# EAGLE design TU56o (EAGLE 6.6.0)
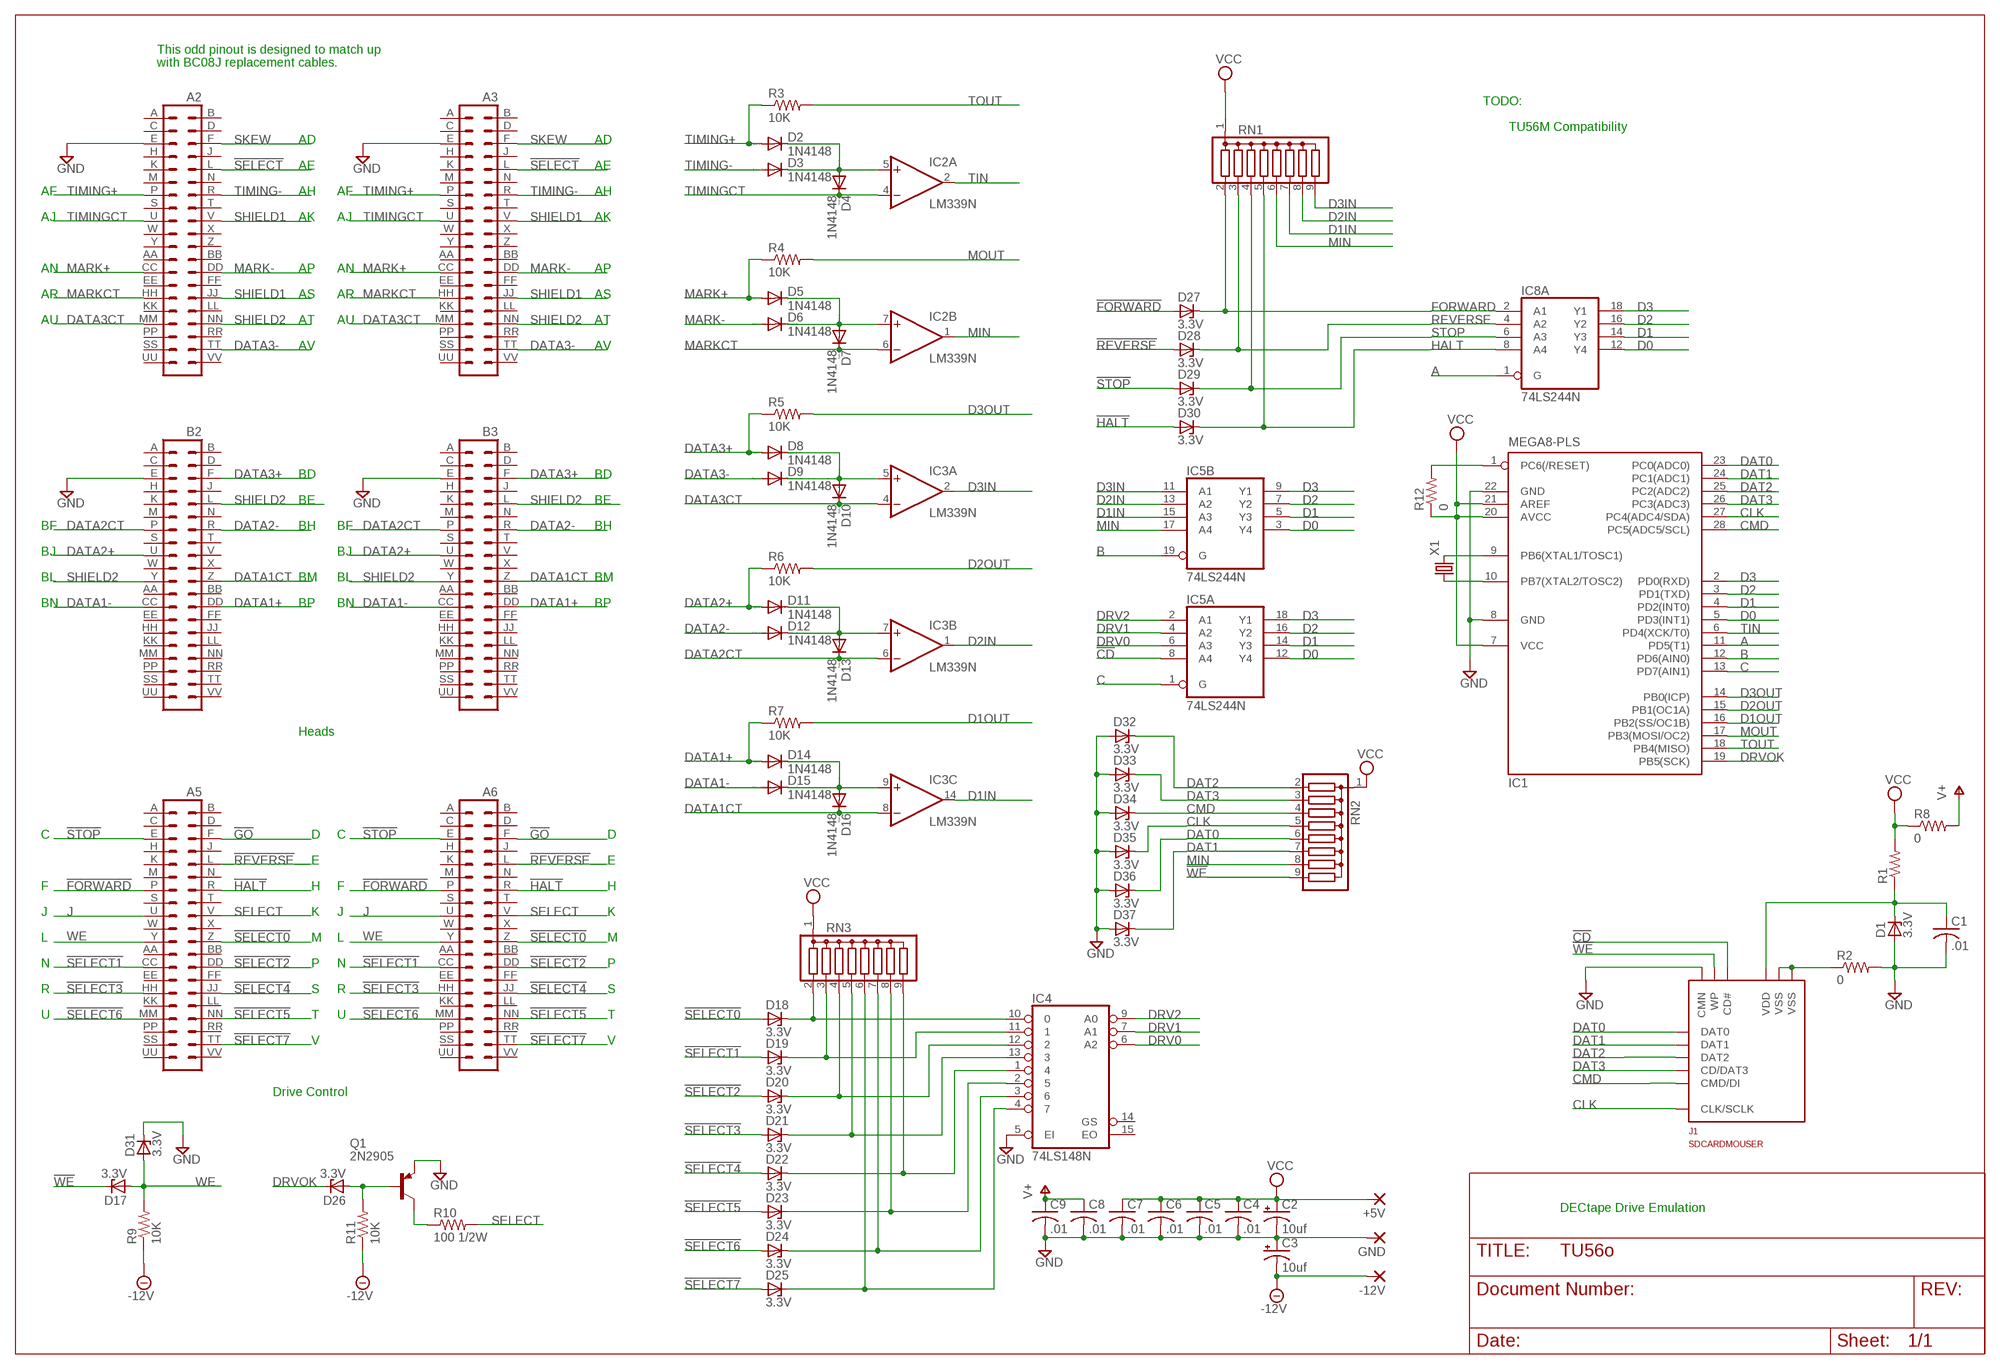
[diagram p0: schematic, sheet 1]

## Parts
+5V  2,15/1,0  [2,15/1,0]
-12V  2,15/1,0  [2,15/1,0]
A2  DEC40PINV  [DEC40PINV]
A3  DEC40PINV  [DEC40PINV]
A5  DEC40PINV  [DEC40PINV]
A6  DEC40PINV  [DEC40PINV]
B2  DEC40PINV  [DEC40PINV]
B3  DEC40PINV  [DEC40PINV]
C1  .01  C-US050-025X075  [C050-025X075]
C2  10uf  CPOL-USE2.5-7  [E2,5-7]
C3  10uf  CPOL-USE2.5-7  [E2,5-7]
C4  .01  C-US050-025X075  [C050-025X075]
C5  .01  C-US050-025X075  [C050-025X075]
C6  .01  C-US050-025X075  [C050-025X075]
C7  .01  C-US050-025X075  [C050-025X075]
C8  .01  C-US050-025X075  [C050-025X075]
C9  .01  C-US050-025X075  [C050-025X075]
D1  3.3V  ZENER-DIODEDO35Z10  [DO35Z10]
D2  1N4148  1N4148DO35-10  [DO35-10]
D3  1N4148  1N4148DO35-10  [DO35-10]
D4  1N4148  1N4148DO35-10  [DO35-10]
D5  1N4148  1N4148DO35-10  [DO35-10]
D6  1N4148  1N4148DO35-10  [DO35-10]
D7  1N4148  1N4148DO35-10  [DO35-10]
D8  1N4148  1N4148DO35-10  [DO35-10]
D9  1N4148  1N4148DO35-10  [DO35-10]
D10  1N4148  1N4148DO35-10  [DO35-10]
D11  1N4148  1N4148DO35-10  [DO35-10]
D12  1N4148  1N4148DO35-10  [DO35-10]
D13  1N4148  1N4148DO35-10  [DO35-10]
D14  1N4148  1N4148DO35-10  [DO35-10]
D15  1N4148  1N4148DO35-10  [DO35-10]
D16  1N4148  1N4148DO35-10  [DO35-10]
D17  3.3V  ZENER-DIODEDO35Z10  [DO35Z10]
D18  3.3V  ZENER-DIODEDO35Z10  [DO35Z10]
D19  3.3V  ZENER-DIODEDO35Z10  [DO35Z10]
D20  3.3V  ZENER-DIODEDO35Z10  [DO35Z10]
D21  3.3V  ZENER-DIODEDO35Z10  [DO35Z10]
D22  3.3V  ZENER-DIODEDO35Z10  [DO35Z10]
D23  3.3V  ZENER-DIODEDO35Z10  [DO35Z10]
D24  3.3V  ZENER-DIODEDO35Z10  [DO35Z10]
D25  3.3V  ZENER-DIODEDO35Z10  [DO35Z10]
D26  3.3V  ZENER-DIODEDO35Z10  [DO35Z10]
D27  3.3V  ZENER-DIODEDO35Z10  [DO35Z10]
D28  3.3V  ZENER-DIODEDO35Z10  [DO35Z10]
D29  3.3V  ZENER-DIODEDO35Z10  [DO35Z10]
D30  3.3V  ZENER-DIODEDO35Z10  [DO35Z10]
D31  3.3V  ZENER-DIODEDO35Z10  [DO35Z10]
D32  3.3V  ZENER-DIODEDO35Z10  [DO35Z10]
D33  3.3V  ZENER-DIODEDO35Z10  [DO35Z10]
D34  3.3V  ZENER-DIODEDO35Z10  [DO35Z10]
D35  3.3V  ZENER-DIODEDO35Z10  [DO35Z10]
D36  3.3V  ZENER-DIODEDO35Z10  [DO35Z10]
D37  3.3V  ZENER-DIODEDO35Z10  [DO35Z10]
GND  2,15/1,0  [2,15/1,0]
IC1  MEGA8-PLS  [DIL28-3]
IC2  LM339N  [DIL14]
IC3  LM339N  [DIL14]
IC4  74LS148N  [DIL16]
IC5  74LS244N  [DIL20]
IC8  74LS244N  [DIL20]
J1  SDCARDMOUSER  [SCDA1A]
Q1  2N2905  [TO5]
R1  R-US_0207/10  [0207/10]
R2  0  R-US_0207/10  [0207/10]
R3  10K  R-US_0207/10  [0207/10]
R4  10K  R-US_0207/10  [0207/10]
R5  10K  R-US_0207/10  [0207/10]
R6  10K  R-US_0207/10  [0207/10]
R7  10K  R-US_0207/10  [0207/10]
R8  0  R-US_0207/10  [0207/10]
R9  10K  R-US_0207/10  [0207/10]
R10  100 1/2W  R-US_0309/V  [0309V]
R11  10K  R-US_0207/10  [0207/10]
R12  0  R-US_0207/10  [0207/10]
RN1  G08R  [SIL9]
RN2  G08R  [SIL9]
RN3  G08R  [SIL9]
X1  CRYSTALHC49S  [HC49/S]

## Nets
!CD: IC5.8(A:A4) J1.10(CD#)
!FORWARD: A5.P A6.P D27.A
!GO: A5.F A6.F
!HALT: A5.R A6.R D30.A
!REVERSE: A5.L A6.L D28.A
!SELECT: A2.L A3.L
!SELECT0: A5.Z A6.Z D18.A
!SELECT1: A5.CC A6.CC D19.A
!SELECT2: A5.DD A6.DD D20.A
!SELECT3: A5.HH A6.HH D21.A
!SELECT4: A5.JJ A6.JJ D22.A
!SELECT5: A5.NN A6.NN D23.A
!SELECT6: A5.MM A6.MM D24.A
!SELECT7: A5.TT A6.TT D25.A
!STOP: A5.E A6.E D29.A
!WE: D17.C J1.12(WP) RN2.9
-12V [Supply]: -12V.1(P) C3.- R9.1 R11.1
A: IC1.11(PD5(T1)) IC8.1(A:G)
B: IC1.12(PD6(AIN0)) IC5.19(B:G)
C: IC1.13(PD7(AIN1)) IC5.1(A:G)
CLK: D35.C IC1.27(PC4(ADC4/SDA)) J1.5(CLK/SCLK) RN2.5
CMD: D34.C IC1.28(PC5(ADC5/SCL)) J1.2(CMD/DI) RN2.4
D0: IC1.5(PD3(INT1)) IC5.3(B:Y4) IC5.12(A:Y4) IC8.12(A:Y4)
D1: IC1.4(PD2(INT0)) IC5.5(B:Y3) IC5.14(A:Y3) IC8.14(A:Y3)
D1IN: IC3.14(C:OUT) IC5.15(B:A3) RN1.7
D1OUT: IC1.16(PB2(SS/OC1B)) R7.2
D2: IC1.3(PD1(TXD)) IC5.7(B:Y2) IC5.16(A:Y2) IC8.16(A:Y2)
D2IN: IC3.1(B:OUT) IC5.13(B:A2) RN1.8
D2OUT: IC1.15(PB1(OC1A)) R6.2
D3: IC1.2(PD0(RXD)) IC5.9(B:Y1) IC5.18(A:Y1) IC8.18(A:Y1)
D3IN: IC3.2(A:OUT) IC5.11(B:A1) RN1.9
D3OUT: IC1.14(PB0(ICP)) R5.2
DAT0: D36.C IC1.23(PC0(ADC0)) J1.7(DAT0) RN2.6
DAT1: D37.C IC1.24(PC1(ADC1)) J1.8(DAT1) RN2.7
DAT2: D32.C IC1.25(PC2(ADC2)) J1.9(DAT2) RN2.2
DAT3: D33.C IC1.26(PC3(ADC3)) J1.1(CD/DAT3) RN2.3
DATA1+: B2.DD B3.DD D14.A R7.1
DATA1-: B2.CC B3.CC D15.A
DATA1CT: B2.Z B3.Z D16.C IC3.8(C:-IN)
DATA2+: B2.U B3.U D11.A R6.1
DATA2-: B2.R B3.R D12.A
DATA2CT: B2.P B3.P D13.C IC3.6(B:-IN)
DATA3+: B2.F B3.F D8.A R5.1
DATA3-: A2.TT A3.TT D9.A
DATA3CT: A2.MM A3.MM D10.C IC3.4(A:-IN)
DRV0: IC4.6(A2) IC5.6(A:A3)
DRV1: IC4.7(A1) IC5.4(A:A2)
DRV2: IC4.9(A0) IC5.2(A:A1)
DRVOK: D26.C IC1.19(PB5(SCK))
FORWARD: D27.C IC8.2(A:A1) RN1.2
GND [Supply]: A2.E A3.E B2.E B3.E C1.2 C2.- C3.+ C4.2 C5.2 C6.2 C7.2 C8.2 C9.2 D1.A D31.C D32.A D33.A D34.A D35.A D36.A D37.A GND.1(P) IC1.8(GND) IC1.22(GND) IC4.5(EI) J1.11(CMN) Q1.1(E) R2.2
HALT: D30.C IC8.8(A:A4) RN1.5
J: A5.U A6.U
MARK+: A2.CC A3.CC D5.A R4.1
MARK-: A2.DD A3.DD D6.A
MARKCT: A2.HH A3.HH D7.C IC2.6(B:-IN)
MIN: IC2.1(B:OUT) IC5.17(B:A4) RN1.6 RN2.8
MOUT: IC1.17(PB3(MOSI/OC2)) R4.2
N$1: IC1.10(PB7(XTAL2/TOSC2)) X1.1
N$2: IC1.9(PB6(XTAL1/TOSC1)) X1.2
N$3: D18.C IC4.10 RN3.2
N$4: D19.C IC4.11 RN3.3
N$5: D20.C IC4.12 RN3.4
N$7: D2.C D3.C D4.A IC2.5(A:+IN)
N$8: D21.C IC4.13 RN3.5
N$9: D22.C IC4.1 RN3.9
N$10: D23.C IC4.2 RN3.8
N$11: D5.C D6.C D7.A IC2.7(B:+IN)
N$12: D8.C D9.C D10.A IC3.5(A:+IN)
N$13: D11.C D12.C D13.A IC3.7(B:+IN)
N$14: D14.C D15.C D16.A IC3.9(C:+IN)
N$15: D24.C IC4.3 RN3.7
N$16: D25.C IC4.4 RN3.6
N$17: IC1.1(PC6(/RESET)) R12.2
N$18: Q1.3(C) R10.1
N$19: D26.A Q1.2(B) R11.2
REVERSE: D28.C IC8.4(A:A2) RN1.3
SELECT: A5.V A6.V R10.2
SHIELD1 [Supply]: A2.JJ A2.V A3.JJ A3.V
SHIELD2 [Supply]: A2.NN A3.NN B2.L B2.Y B3.L B3.Y
SKEW: A2.F A3.F
STOP: D29.C IC8.6(A:A3) RN1.4
TIMING+: A2.P A3.P D2.A R3.1
TIMING-: A2.R A3.R D3.A
TIMINGCT: A2.U A3.U D4.C IC2.4(A:-IN)
TIN: IC1.6(PD4(XCK/T0)) IC2.2(A:OUT)
TOUT: IC1.18(PB4(MISO)) R3.2
V+ [Supply]: C8.1 C9.1 R8.2
VCC [Supply]: +5V.1(P) C2.+ C4.1 C5.1 C6.1 C7.1 IC1.7(VCC) IC1.20(AVCC) IC1.21(AREF) R1.2 R8.1 R12.1 RN1.1 RN2.1 RN3.1
VDD [Supply]: C1.1 D1.C J1.4(VDD) R1.1
VSS [Supply]: J1.3(VSS) J1.6(VSS) R2.1
WE: A5.Y A6.Y D17.A D31.A R9.2
Unconnected: A2.A A2.AA A2.B A2.BB A2.C A2.D A2.EE A2.FF A2.H A2.J A2.K A2.KK A2.LL A2.M A2.N A2.PP A2.RR A2.S A2.SS A2.T A2.UU A2.VV A2.W A2.X A2.Y A2.Z A3.A A3.AA A3.B A3.BB A3.C A3.D A3.EE A3.FF A3.H A3.J A3.K A3.KK A3.LL A3.M A3.N A3.PP A3.RR A3.S A3.SS A3.T A3.UU A3.VV A3.W A3.X A3.Y A3.Z A5.A A5.AA A5.B A5.BB A5.C A5.D A5.EE A5.FF A5.H A5.J A5.K A5.KK A5.LL A5.M A5.N A5.PP A5.RR A5.S A5.SS A5.T A5.UU A5.VV A5.W A5.X A6.A A6.AA A6.B A6.BB A6.C A6.D A6.EE A6.FF A6.H A6.J A6.K A6.KK A6.LL A6.M A6.N A6.PP A6.RR A6.S A6.SS A6.T A6.UU A6.VV A6.W A6.X B2.A B2.AA B2.B B2.BB B2.C B2.D B2.EE B2.FF B2.H B2.HH B2.J B2.JJ B2.K B2.KK B2.LL B2.M B2.MM B2.N B2.NN B2.PP B2.RR B2.S B2.SS B2.T B2.TT B2.UU B2.V B2.VV B2.W B2.X B3.A B3.AA B3.B B3.BB B3.C B3.D B3.EE B3.FF B3.H B3.HH B3.J B3.JJ B3.K B3.KK B3.LL B3.M B3.MM B3.N B3.NN B3.PP B3.RR B3.S B3.SS B3.T B3.TT B3.UU B3.V B3.VV B3.W B3.X IC2.8(C:-IN) IC2.9(C:+IN) IC2.10(D:-IN) IC2.11(D:+IN) IC2.13(D:OUT) IC2.14(C:OUT) IC3.10(D:-IN) IC3.11(D:+IN) IC3.13(D:OUT) IC4.14(GS) IC4.15(EO) IC8.3(B:Y4) IC8.5(B:Y3) IC8.7(B:Y2) IC8.9(B:Y1) IC8.11(B:A1) IC8.13(B:A2) IC8.15(B:A3) IC8.17(B:A4) IC8.19(B:G)

## Notes on the sheet
- This odd pinout is designed to match up
- with BC08J replacement cables.
- TODO:
- TU56M Compatibility
- AD | AD
- AE | AE
- AF | AH | AF | AH
- AJ | AK | AJ | AK
- AN | AP | AN | AP
- AR | AS | AR | AS
- AU | AT | AU | AT
- AV | AV
- BD | BD
- BE | BE
- BF | BH | BF | BH
- BJ | BJ
- BL | BM | BL | BM
- BN | BP | BN | BP
- Heads
- C | D | C | D
- E | E
- F | H | F | H
- J | K | J | K
- L | M | L | M
- N | P | N | P
- R | S | R | S
- U | T | U | T
- V | V
- Drive Control
- DECtape Drive Emulation

## Power pins joined to a net without a drawn wire
GND: IC2.12(P:GND) IC3.12(P:GND) IC4.8(GND) IC5.10(P:GND) IC8.10(P:GND) J1.13(GND) J1.14(GND)
V+: IC2.3(P:V+) IC3.3(P:V+)
VCC: IC4.16(VCC) IC5.20(P:VCC) IC8.20(P:VCC)

## Library data of the parts
+5V -12V GND = wirepad:2,15/1,0: THROUGH-HOLE PAD
A2 A3 A5 A6 B2 B3 = dec-con:DEC40PIN: PIN HEADER
C1 C4-C9 = rcl:C-US: CAPACITOR, American symbol
C2 C3 = rcl:CPOL-US: POLARIZED CAPACITOR, American symbol
D1 D17-D37 = diode:ZENER-DIODE: Z-Diode
D2-D16 = diode:1N4148: DIODE high speed (Philips)
IC1 = atmel:MEGA8-P: MICROCONTROLLER 8 Kbytes FLASH, 1 kbytes SRAM, 512 bytes EEPROM, USART, 4-channel 10 bit ADC, 2-channel 8 bit ADC Pin compatible with Atmega48, ATMega88, ATMega168 Source: avr.lbr
IC2 IC3 = linear:LM339: Low Power Low Offset Voltage Quad Comparators with open collector; LM139/LM239/LM339/LM2901/LM3302
IC4 = 74xx-us:74*148: 10-line to 4-line and 8-line to 3-line PRIORITY ENCODER
IC5 IC8 = 74xx-us:74*244: Octal BUFFER and LINE DRIVER, 3-state
J1 = sdcards:SDCARD: SD Card Holder
Q1 = transistor-pnp:2N2905: PNP Transistor
R1-R12 = rcl:R-US_: RESISTOR, American symbol
RN1-RN3 = resistor-sil:G08R: SIL RESISTOR; OC_FARNELL: unknown; OC_NEWARK: unknown
X1 = crystal:CRYSTAL: CRYSTAL; OC_FARNELL: 1667008; OC_NEWARK: unknown

## Net classes
1 Supply: width 0.508 mm, clearance 0.381 mm

## Board
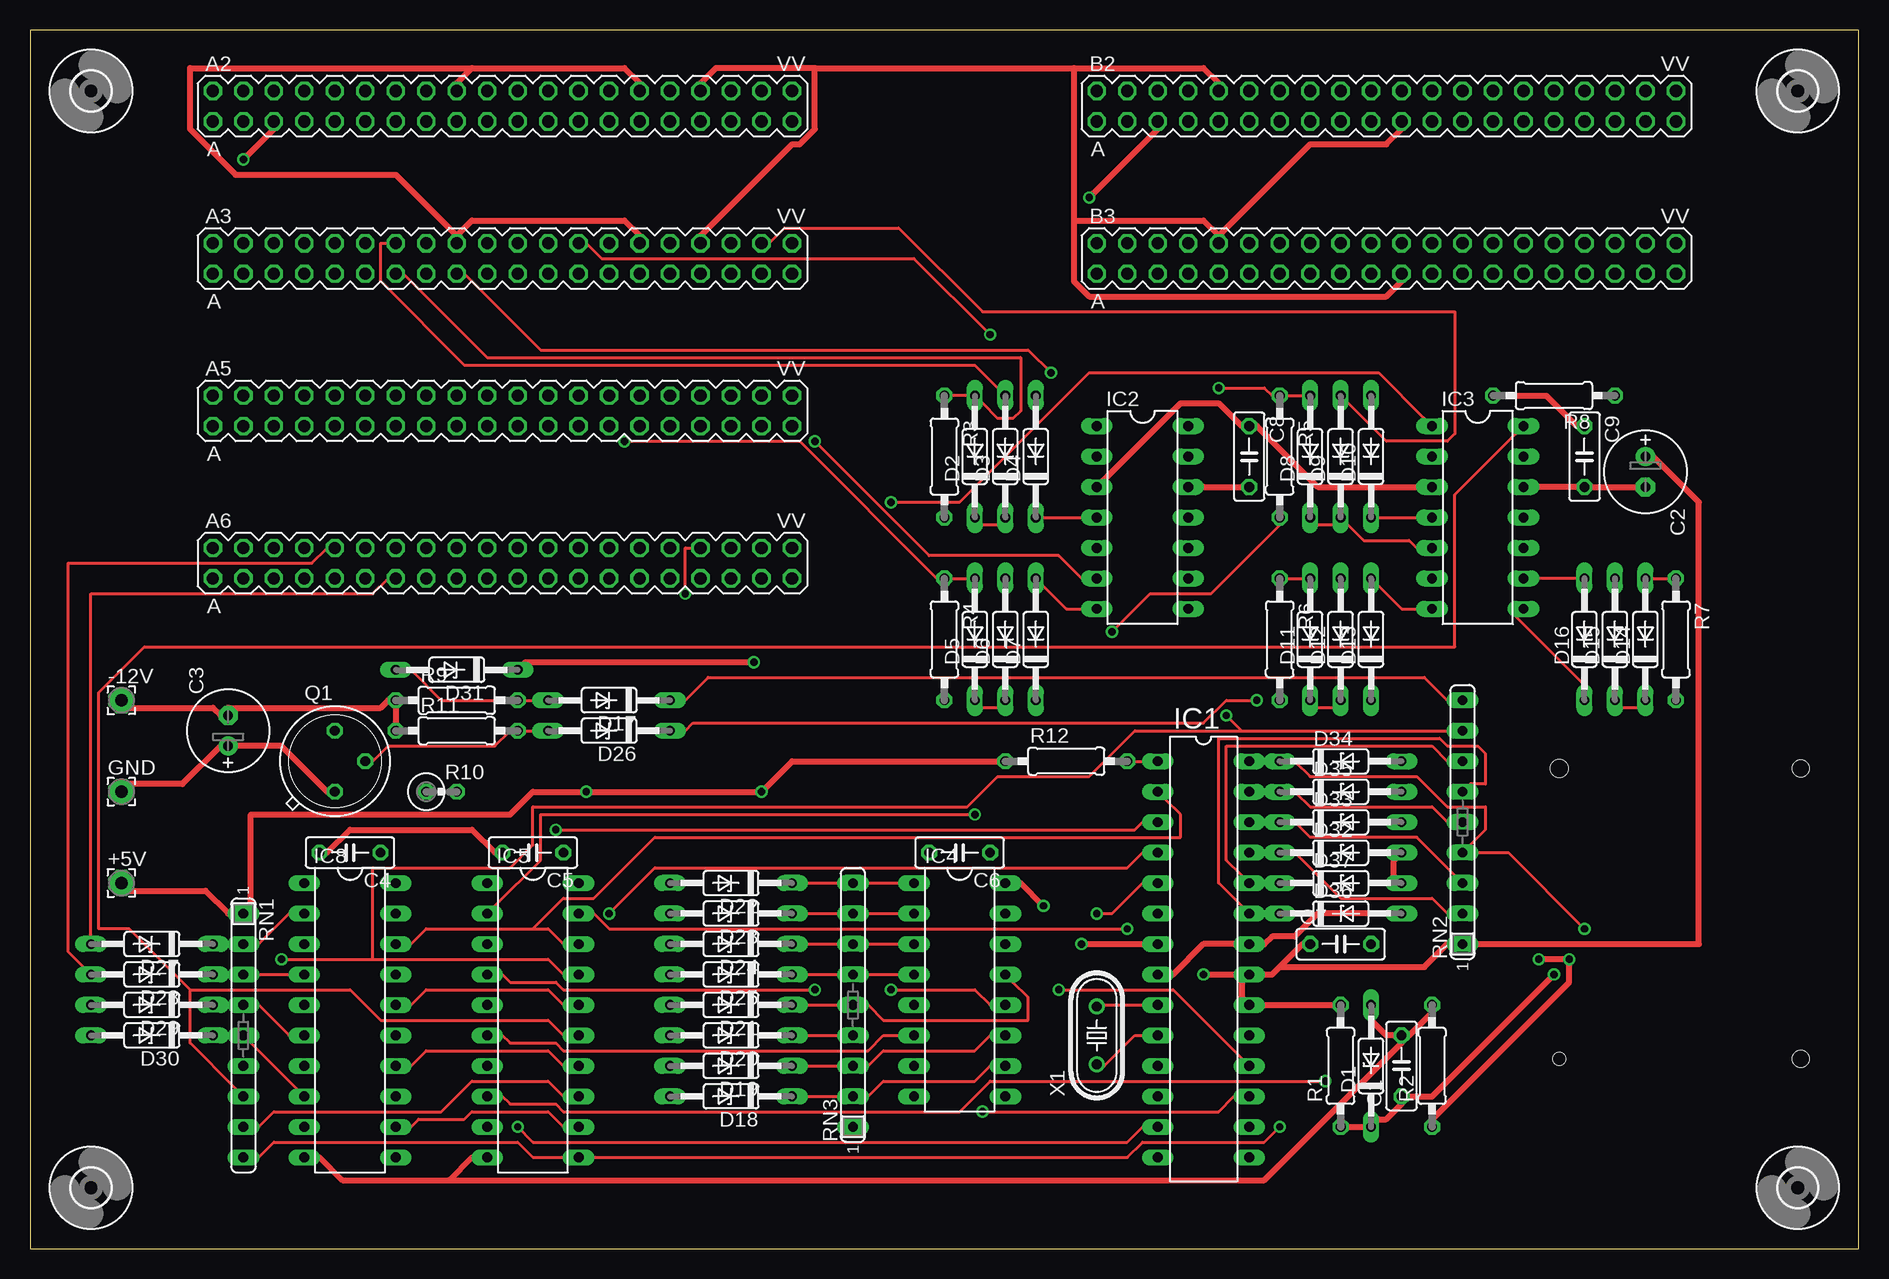
[diagram p1: board, top side]
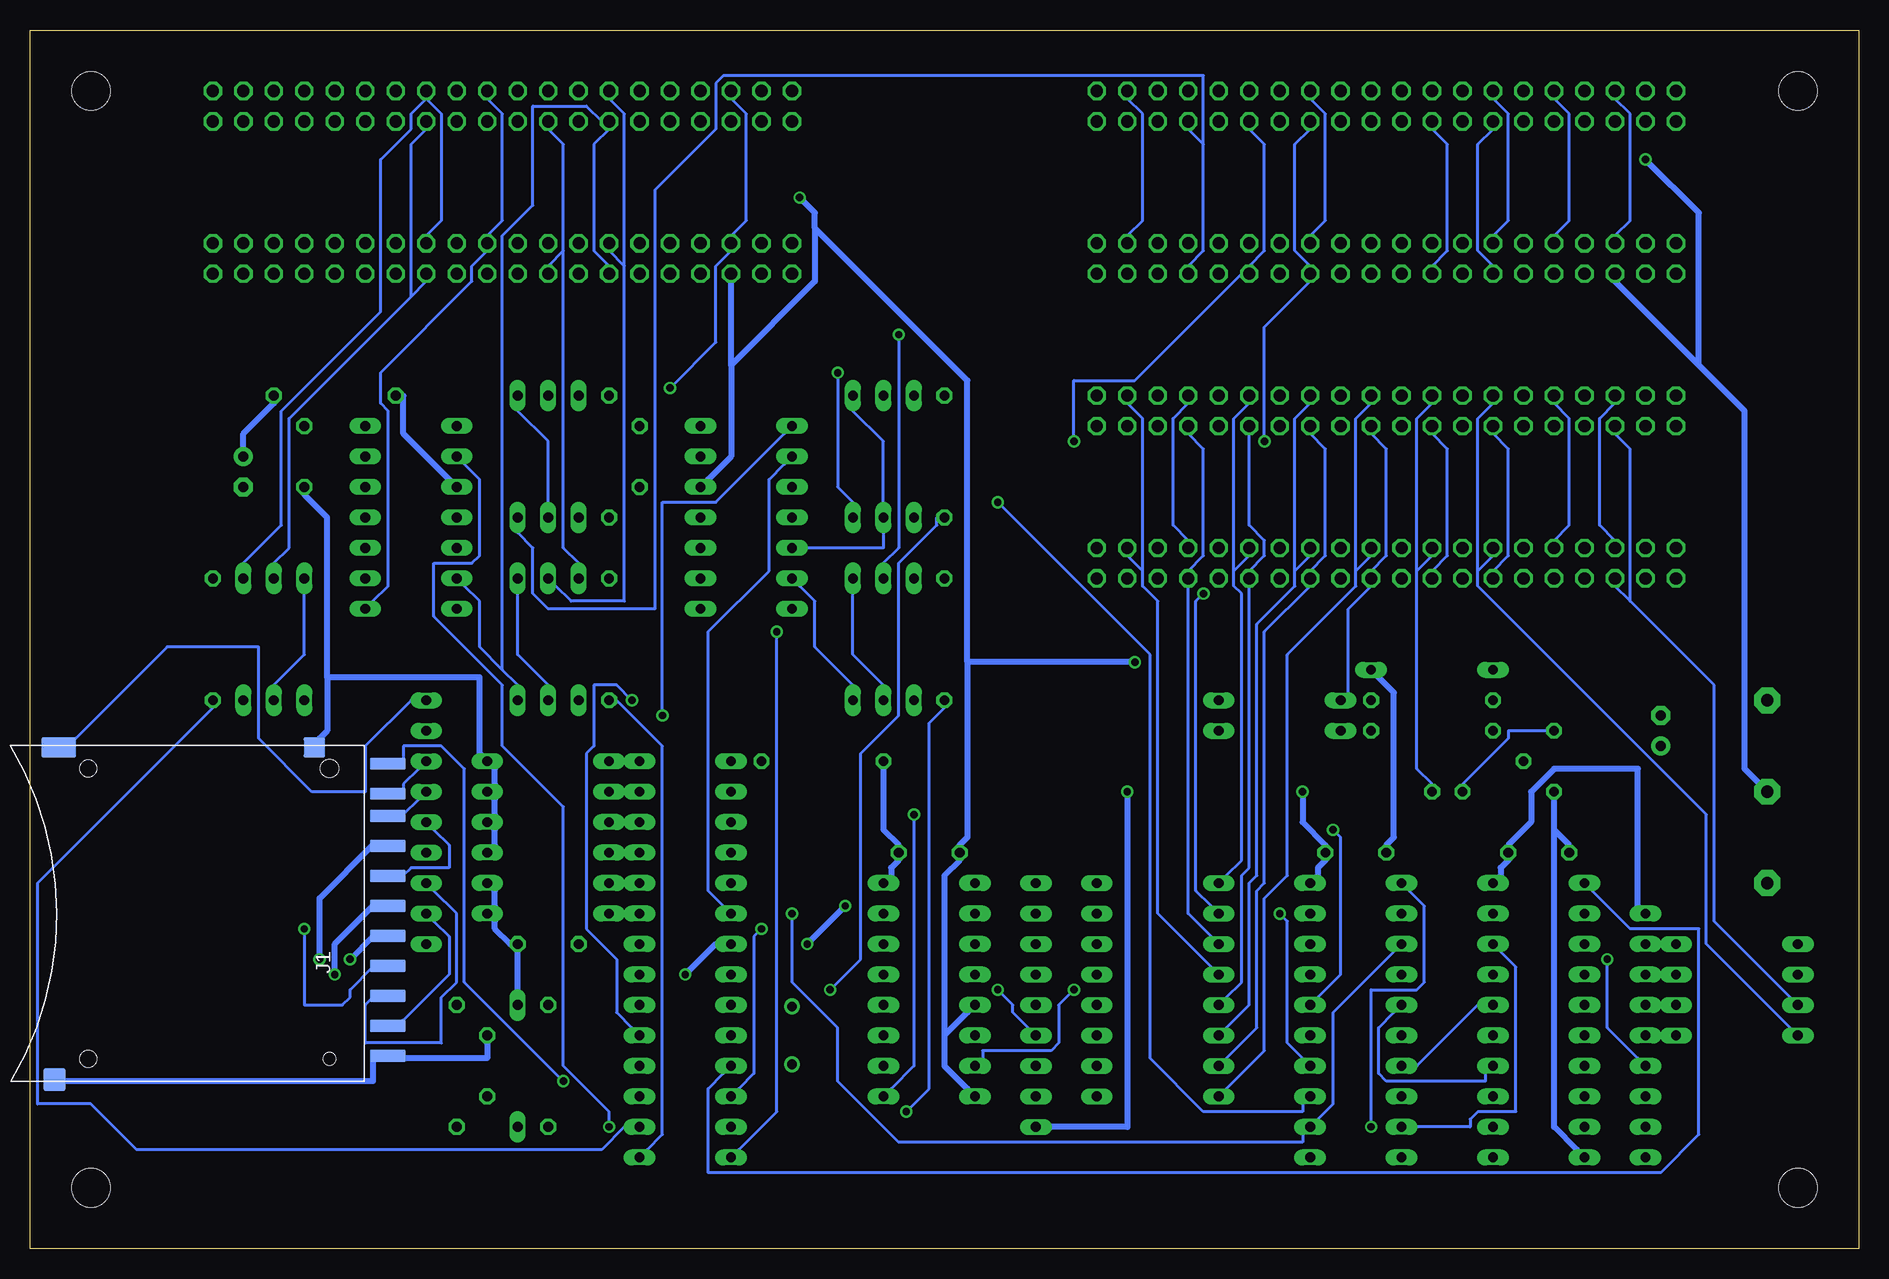
[diagram p2: board, bottom side, seen from below]

Size 152.4 x 101.6 mm. Coordinates in mm from the lower left corner, seen from the top.
Outline: 0,0 152.4,0 152.4,101.6 0,101.6 0,0
Copper layers (1*16): Top 0.035mm / dielectric 1.5mm / Bottom 0.035mm
Design rules "custompcb": minimum track width 10mil, minimum drill 24mil, track to track 8mil, track to pad 8mil, pad to pad 8mil, via to via 8mil, smd to smd 0mil, copper to edge 10mil, drill to drill 8mil, minimum pad ring 10mil, minimum via ring 8mil, stop-mask expansion 4mil, vias tented up to drill 0mil, thermal gap 10mil

### Footprints (pad centres in the part's own frame; a part is rotated, then mirrored left to right if it is on the bottom)
2,15/1,0 = drill 1.016 pad 2.159 octagon: 1 0,0
DEC40PINV = drill 1.016 octagon: A -24.13,-1.27; AA 3.81,-1.27; B -24.13,1.27; BB 3.81,1.27; C -21.59,-1.27; CC 6.35,-1.27; D -21.59,1.27; DD 6.35,1.27; E -19.05,-1.27; EE 8.89,-1.27; F -19.05,1.27; FF 8.89,1.27; H -16.51,-1.27; HH 11.43,-1.27; J -16.51,1.27; JJ 11.43,1.27; K -13.97,-1.27; KK 13.97,-1.27; L -13.97,1.27; LL 13.97,1.27; M -11.43,-1.27; MM 16.51,-1.27; N -11.43,1.27; NN 16.51,1.27; P -8.89,-1.27; PP 19.05,-1.27; R -8.89,1.27; RR 19.05,1.27; S -6.35,-1.27; SS 21.59,-1.27; T -6.35,1.27; TT 21.59,1.27; U -3.81,-1.27; UU 24.13,-1.27; V -3.81,1.27; VV 24.13,1.27; W -1.27,-1.27; X -1.27,1.27; Y 1.27,-1.27; Z 1.27,1.27
C050-025X075 = drill 0.813 octagon: 1 -2.54,0; 2 2.54,0
E2,5-7 = drill 0.813 pad 1.6: + -1.27,0 | drill 0.813 pad 1.6 octagon: - 1.27,0
DO35Z10 = drill 0.813 long: A 5.08,0; C -5.08,0
DO35-10 = drill 0.813 long: A 5.08,0; C -5.08,0
DIL28-3 = drill 0.813 long: 1 -16.51,-3.81; 2 -13.97,-3.81; 3 -11.43,-3.81; 4 -8.89,-3.81; 5 -6.35,-3.81; 6 -3.81,-3.81; 7 -1.27,-3.81; 8 1.27,-3.81; 9 3.81,-3.81; 10 6.35,-3.81; 11 8.89,-3.81; 12 11.43,-3.81; 13 13.97,-3.81; 14 16.51,-3.81; 15 16.51,3.81; 16 13.97,3.81; 17 11.43,3.81; 18 8.89,3.81; 19 6.35,3.81; 20 3.81,3.81; 21 1.27,3.81; 22 -1.27,3.81; 23 -3.81,3.81; 24 -6.35,3.81; 25 -8.89,3.81; 26 -11.43,3.81; 27 -13.97,3.81; 28 -16.51,3.81
DIL14 = drill 0.813 long: 1 -7.62,-3.81; 2 -5.08,-3.81; 3 -2.54,-3.81; 4 0,-3.81; 5 2.54,-3.81; 6 5.08,-3.81; 7 7.62,-3.81; 8 7.62,3.81; 9 5.08,3.81; 10 2.54,3.81; 11 0,3.81; 12 -2.54,3.81; 13 -5.08,3.81; 14 -7.62,3.81
DIL16 = drill 0.813 long: 1 -8.89,-3.81; 2 -6.35,-3.81; 3 -3.81,-3.81; 4 -1.27,-3.81; 5 1.27,-3.81; 6 3.81,-3.81; 7 6.35,-3.81; 8 8.89,-3.81; 9 8.89,3.81; 10 6.35,3.81; 11 3.81,3.81; 12 1.27,3.81; 13 -1.27,3.81; 14 -3.81,3.81; 15 -6.35,3.81; 16 -8.89,3.81
DIL20 = drill 0.813 long: 1 -11.43,-3.81; 2 -8.89,-3.81; 3 -6.35,-3.81; 4 -3.81,-3.81; 5 -1.27,-3.81; 6 1.27,-3.81; 7 3.81,-3.81; 8 6.35,-3.81; 9 8.89,-3.81; 10 11.43,-3.81; 11 11.43,3.81; 12 8.89,3.81; 13 6.35,3.81; 14 3.81,3.81; 15 1.27,3.81; 16 -1.27,3.81; 17 -3.81,3.81; 18 -6.35,3.81; 19 -8.89,3.81; 20 -11.43,3.81
SCDA1A = smd 1 x 2.95: 1 -6.865,-10.76; 2 -4.365,-10.76; 3 -1.865,-10.76; 4 0.635,-10.76; 5 3.135,-10.76; 6 5.635,-10.76; 7 8.135,-10.76; 8 10,-10.76; 9 -9.365,-10.76; 10 12.5,-10.76; 13 -11.865,-10.76 | smd 1.7 x 1.8: 11 13.85,-4.65 | smd 1.7 x 2.9: 12 13.85,16.65 | smd 1.9 x 1.8: 14 -13.85,17 | hole 1.05: -12.1,-5.9 | hole 1.5: 12.1,-5.9 | hole 1.4: 12.1,14.2; -12.1,14.2
TO5 = drill 0.813 octagon: 1 0,-2.54; 2 2.54,0; 3 0,2.54
0207/10 = drill 0.813 octagon: 1 -5.08,0; 2 5.08,0
0309V = drill 0.813 octagon: 1 -1.27,0; 2 1.27,0
SIL9 = drill 0.813 long: 1 -10.16,0; 2 -7.62,0; 3 -5.08,0; 4 -2.54,0; 5 0,0; 6 2.54,0; 7 5.08,0; 8 7.62,0; 9 10.16,0
3,2 = hole 3.2: 0,0
HC49/S = drill 0.813: 1 -2.413,0; 2 2.413,0

### Placement (x,y rotation side)
+5V  7.62,30.48 0 top
-12V  7.62,45.72 0 top
A2  39.37,95.25 0 top
A3  39.37,82.55 0 top
A5  39.37,69.85 0 top
A6  39.37,57.15 0 top
B2  113.03,95.25 0 top
B3  113.03,82.55 0 top
C1  114.3,15.24 90 top
C2  134.62,64.77 270 top
C3  16.51,43.18 90 top
C4  26.67,33.02 180 top
C5  41.91,33.02 180 top
C6  77.47,33.02 180 top
C7  109.22,25.4 0 top
C8  101.6,66.04 270 top
C9  129.54,66.04 270 top
D1  111.76,15.24 90 top
D2  78.74,66.04 90 top
D3  81.28,66.04 90 top
D4  83.82,66.04 90 top
D5  78.74,50.8 90 top
D6  81.28,50.8 90 top
D7  83.82,50.8 90 top
D8  106.68,66.04 90 top
D9  109.22,66.04 90 top
D10  111.76,66.04 90 top
D11  106.68,50.8 90 top
D12  109.22,50.8 90 top
D13  111.76,50.8 90 top
D14  134.62,50.8 90 top
D15  132.08,50.8 90 top
D16  129.54,50.8 90 top
D17  48.26,45.72 180 top
D18  58.42,12.7 180 top
D19  58.42,15.24 180 top
D20  58.42,17.78 180 top
D21  58.42,20.32 180 top
D22  58.42,30.48 180 top
D23  58.42,27.94 180 top
D24  58.42,25.4 180 top
D25  58.42,22.86 180 top
D26  48.26,43.18 180 top
D27  10.16,25.4 180 top
D28  10.16,22.86 180 top
D29  10.16,20.32 180 top
D30  10.16,17.78 180 top
D31  35.56,48.26 180 top
D32  109.22,33.02 0 top
D33  109.22,35.56 0 top
D34  109.22,40.64 0 top
D35  109.22,38.1 0 top
D36  109.22,27.94 0 top
D37  109.22,30.48 0 top
GND  7.62,38.1 0 top
IC1  97.79,24.13 270 top
IC2  92.71,60.96 270 top
IC3  120.65,60.96 270 top
IC4  77.47,21.59 270 top
IC5  41.91,19.05 270 top
IC8  26.67,19.05 270 top
J1  133.35,27.94 90 bottom
Q1  25.4,40.64 0 top
R1  109.22,15.24 90 top
R2  116.84,15.24 90 top
R3  76.2,66.04 270 top
R4  76.2,50.8 270 top
R5  104.14,66.04 270 top
R6  104.14,50.8 270 top
R7  137.16,50.8 270 top
R8  127,71.12 180 top
R9  35.56,45.72 0 top
R10  34.29,38.1 0 top
R11  35.56,43.18 0 top
R12  86.36,40.64 0 top
RN1  17.78,17.78 270 top
RN2  119.38,35.56 90 top
RN3  68.58,20.32 90 top
U$1  [3,2]  5.08,5.08 0 top
U$2  [3,2]  5.08,96.52 0 top
U$3  [3,2]  147.32,96.52 0 top
U$4  [3,2]  147.32,5.08 0 top
X1  88.9,17.78 90 top

### Tracks (layer width: path | path; a pad name or v marks a point on that pad's centre or on a via)
!CD  (via drill 0.61)
  Top 0.254: v107.95,13.97 80.01,13.97 77.47,11.43 44.45,11.43 43.81,12.06 40.01,12.06 39.37,12.7 IC5.8
  Bottom 0.254: v107.95,13.97 116.2,22.23 116.2,40.01 118.11,41.91 121.28,41.91 121.28,40.64 J1.10
!FORWARD
  Top 0.254: D27.A 5.08,26.04 5.08,54.61 28.57,54.61 29.84,55.88 A6.P
  Bottom 0.254: A5.P 30.48,67.94 29.21,66.67 29.21,57.78 30.48,56.52 A6.P
!GO
  Bottom 0.254: A6.F 20.32,59.05 21.59,60.33 21.59,69.22 20.32,70.48 A5.F
!HALT
  Bottom 0.254: 31.75,56.52 31.75,55.24 12.7,36.2 12.7,25.4 5.71,18.41 D30.A | 31.75,56.52 30.48,57.78 A6.R | 31.75,56.52 31.75,69.22 30.48,70.48 A5.R
!REVERSE
  Top 0.254: D28.A 4.45,23.5 3.17,24.77 3.17,57.15 23.5,57.15 24.77,58.42 A6.L
  Bottom 0.254: A5.L 25.4,70.48 24.13,69.22 24.13,60.33 25.4,59.05 A6.L
!SELECT
  Bottom 0.254: A3.L 25.4,84.45 24.13,85.72 24.13,94.61 25.4,95.89 A2.L
!SELECT0
  Bottom 0.254: 41.91,56.52 41.91,55.24 47.62,49.53 47.62,31.11 49.53,29.21 49.53,16.51 52.7,13.34 D18.A | 41.91,56.52 40.64,57.78 A6.Z | 41.91,56.52 41.91,69.22 40.64,70.48 A5.Z
!SELECT1
  Bottom 0.254: D19.A 52.7,15.88 50.16,18.41 50.16,29.84 49.53,30.48 49.53,51.44 45.72,55.24 A6.CC 45.72,56.52 44.45,57.78 44.45,66.67 45.72,67.94 A5.CC
!SELECT2
  Bottom 0.254: 46.99,56.52 46.99,55.24 50.16,52.07 50.16,31.11 50.8,30.48 50.8,20.32 52.7,18.41 D20.A | 46.99,56.52 45.72,57.78 A6.DD | 46.99,56.52 46.99,69.22 45.72,70.48 A5.DD
!SELECT3
  Bottom 0.254: D21.A 52.7,20.95 51.44,22.23 51.44,31.11 50.8,31.75 50.8,55.24 A6.HH 50.8,56.52 49.53,57.78 49.53,59.05 50.8,60.33 50.8,67.94 A5.HH
!SELECT4
  Bottom 0.254: 52.07,56.52 52.07,55.24 51.44,54.61 51.44,32.38 52.7,31.11 D22.A | 52.07,56.52 50.8,57.78 A6.JJ | 52.07,56.52 52.07,69.22 50.8,70.48 A5.JJ
!SELECT5  (via drill 0.61)
  Top 0.254: v54.61,54.61 54.61,58.42 55.24,58.42 A6.NN
  Bottom 0.254: v54.61,54.61 55.24,53.98 55.24,29.84 53.98,28.57 D23.A | A5.NN 55.88,70.48 57.15,69.22 57.15,60.33 55.88,59.05 A6.NN
!SELECT6
  Bottom 0.254: D24.A 53.98,26.04 55.88,27.94 55.88,55.24 A6.MM 55.88,56.52 54.61,57.78 54.61,66.67 55.88,67.94 A5.MM
!SELECT7
  Bottom 0.254: 59.69,56.52 59.69,55.24 58.42,53.98 58.42,27.94 53.98,23.5 D25.A | 59.69,56.52 60.96,57.78 A6.TT | 59.69,56.52 59.69,69.22 60.96,70.48 A5.TT
!STOP
  Bottom 0.254: 19.05,53.98 20.32,55.24 A6.E | 19.05,53.98 12.06,46.99 12.06,27.3 5.71,20.95 D29.A | 19.05,53.98 19.05,66.67 20.32,67.94 A5.E
!WE
  Top 0.254: D17.C 54.61,45.72 56.52,47.62 116.2,47.62 118.11,45.72 RN2.9
  Bottom 0.254: J1.12 148.59,42.55 140.97,50.16 133.35,50.16 133.35,42.55 128.91,38.1 124.46,38.1 124.46,41.91 120.65,45.72 RN2.9
-12V
  Top 0.508: R11.1 30.48,43.81 30.48,45.09 R9.1 29.84,45.72 29.21,45.09 16.51,45.09 C3.- 15.88,44.45 15.24,45.09 8.26,45.09 -12V.1
A
  Bottom 0.254: IC8.1 22.23,29.84 19.05,26.67 13.34,26.67 13.34,9.53 16.51,6.35 95.89,6.35 95.89,13.34 94.61,14.61 IC1.11
B  (via drill 0.61)
  Top 0.254: v91.44,26.67 48.26,26.67 46.99,27.94 IC5.19
  Bottom 0.254: v91.44,26.67 92.08,26.04 92.08,14.61 93.34,13.34 IC1.12
C  (via drill 0.61)
  Top 0.254: v40.64,10.16 41.91,8.89 91.44,8.89 92.71,10.16 IC1.13
  Bottom 0.254: v40.64,10.16 40.64,21.59 36.83,21.59 36.2,22.23 36.2,28.57 37.47,29.84 IC5.1
CLK
  Top 0.254: RN2.5 118.11,35.56 116.84,36.83 106.68,36.83 105.41,38.1 D35.C 102.87,38.1 IC1.27
  Bottom 0.254: J1.5 121.28,31.11 120.65,31.75 117.47,31.75 117.47,33.66 118.75,34.92 RN2.5
CMD  (via drill 0.61)
  Top 0.254: IC1.28 102.87,40.64 D34.C 105.41,40.64 106.68,39.37 115.57,39.37 118.11,36.83 121.28,36.83 121.28,34.92 120.02,33.66 RN2.4 120.65,33.02 123.19,33.02 v129.54,26.67
  Bottom 0.254: v129.54,26.67 129.54,20.32 126.36,20.32 125.73,20.95 125.73,21.59 123.83,23.5 J1.2
D0  (via drill 0.61)
  Top 0.254: IC8.12 31.75,10.16 32.38,10.79 36.2,10.79 36.83,11.43 43.18,11.43 44.45,10.16 IC5.12 | v88.9,27.94 90.17,27.94 92.71,30.48 IC1.5
  Bottom 0.254: IC5.3 38.73,24.77 43.81,19.68 43.81,12.06 45.09,10.79 IC5.12 46.35,9.53 46.35,8.89 80.01,8.89 85.09,13.97 85.09,18.41 88.9,22.23 v88.9,27.94
D1  (via drill 0.61)
  Top 0.254: IC8.14 31.75,15.24 33.02,16.51 43.18,16.51 44.45,15.24 IC5.14 | v48.26,27.94 52.07,31.75 91.44,31.75 92.71,33.02 IC1.4
  Bottom 0.254: IC5.5 38.73,19.68 40.01,18.41 40.01,14.61 39.37,13.97 31.11,13.97 31.11,14.61 IC8.14 | v48.26,27.94 47.62,27.3 47.62,17.14 46.35,15.88 IC5.14
D1IN
  Top 0.254: 13.34,21.59 13.34,17.14 17.14,13.34 RN1.7 | 13.34,21.59 26.67,21.59 29.21,19.05 43.18,19.05 44.45,17.78 IC5.15 | 13.34,21.59 8.26,26.67 5.71,26.67 5.71,46.35 9.53,50.16 118.75,50.16 118.75,62.87 123.83,67.94 IC3.14
D1OUT
  Bottom 0.254: IC1.16 102.87,10.16 104.78,8.26 143.51,8.26 147.32,12.06 151.76,12.06 151.76,30.48 137.16,45.09 R7.2
D2  (via drill 0.61)
  Top 0.254: IC5.16 44.45,20.32 43.18,21.59 33.02,21.59 31.75,20.32 IC8.16 | v43.81,34.92 92.08,34.92 92.71,35.56 IC1.3
  Bottom 0.254: IC5.7 36.83,15.24 31.75,20.32 IC8.16 | v43.81,34.92 43.18,34.29 43.18,22.86 45.09,20.95 IC5.16
D2IN  (via drill 0.61)
  Top 0.254: RN1.8 19.05,10.16 20.32,11.43 34.29,11.43 36.83,13.97 43.18,13.97 44.45,12.7 IC5.13 | v71.75,62.23 77.47,62.23 88.27,73.03 112.39,73.03 116.2,69.22 IC3.1
  Bottom 0.254: v71.75,62.23 59.05,49.53 59.05,15.88 54.61,11.43 46.35,11.43 46.35,12.06 IC5.13
D2OUT
  Bottom 0.254: IC1.15 100.97,8.26 99.69,9.53 99.69,41.91 103.5,45.72 R6.2
D3
  Top 0.254: 41.91,26.67 33.02,26.67 31.75,25.4 IC8.18 | 41.91,26.67 43.18,26.67 44.45,25.4 IC5.18 | 41.91,26.67 44.45,29.21 46.99,29.21 52.07,34.29 95.89,34.29 95.89,36.2 94.61,37.47 IC1.2
  Bottom 0.254: IC5.9 36.83,10.16 32.38,10.16 32.38,10.79 31.75,11.43 28.57,11.43 28.57,23.5 29.84,24.77 IC8.18
D3IN  (via drill 0.61)
  Top 0.254: RN1.9 19.05,7.62 20.32,8.89 40.64,8.89 41.91,7.62 44.45,7.62 IC5.11 46.99,7.62 91.44,7.62 92.71,8.89 102.87,8.89 v104.14,10.16
  Bottom 0.254: v104.14,10.16 104.14,11.43 107.95,15.24 107.95,36.83 113.03,41.91 113.03,46.99 118.75,52.7 118.75,57.15 115.57,57.15 114.94,57.78 114.94,64.14 116.2,65.41 IC3.2
D3OUT  (via drill 0.61)
  Top 0.254: v90.17,51.44 93.34,54.61 98.42,54.61 104.14,60.33 R5.2
  Bottom 0.254: v90.17,51.44 90.17,11.43 93.34,8.26 IC1.14
DAT0
  Top 0.254: D36.C 102.87,27.94 IC1.23 100.97,28.57 99.06,30.48 99.06,42.55 117.47,42.55 118.11,41.91 120.65,41.91 121.28,41.27 121.28,38.73 120.02,38.73 RN2.6
  Bottom 0.254: RN2.6 120.02,37.47 121.28,36.2 J1.7
DAT1
  Top 0.254: D37.C 102.87,30.48 IC1.24 100.97,31.11 99.69,32.38 99.69,41.91 116.84,41.91 118.11,40.64 RN2.7
  Bottom 0.254: RN2.7 120.02,40.01 121.28,38.73 121.28,38.1 J1.8
DAT2
  Top 0.254: IC1.25 102.87,33.02 D32.C 105.41,33.02 109.22,29.21 116.84,29.21 118.11,27.94 RN2.2
  Bottom 0.254: RN2.2 118.75,27.3 117.47,26.04 117.47,22.86 121.28,19.05 J1.9
DAT3
  Top 0.254: IC1.26 102.87,35.56 D33.C 105.41,35.56 106.68,34.29 115.57,34.29 118.75,31.11 RN2.3
  Bottom 0.254: J1.1 123.83,20.95 124.46,20.32 124.46,17.14 118.11,17.14 118.11,20.95 116.84,22.23 116.84,27.94 118.75,29.84 RN2.3
DATA1+
  Top 0.254: D14.A 135.25,55.88 136.53,55.88 R7.1
  Bottom 0.254: 119.38,95.89 118.11,94.61 118.11,85.72 119.38,84.45 B3.DD | 119.38,95.89 B2.DD 119.38,95.89 | 119.38,95.89 120.65,94.61 120.65,93.34 123.19,90.81 123.19,78.11 131.44,69.85 131.44,60.33 134.62,57.15 D14.A
DATA1-
  Bottom 0.254: 120.65,79.38 119.38,80.64 B3.CC | 120.65,79.38 130.81,69.22 130.81,58.42 132.08,57.15 D15.A | 120.65,79.38 120.65,92.08 119.38,93.34 B2.CC
DATA1CT
  Top 0.254: D16.C 129.54,46.99 123.83,52.7 IC3.8
  Bottom 0.254: B2.Z 114.3,95.89 113.03,94.61 113.03,85.72 114.3,84.45 B3.Z 114.3,83.19 115.57,81.92 115.57,80.64 123.19,73.03 123.19,70.48 122.56,69.85 122.56,55.24 123.83,53.98 IC3.8
DATA2+
  Top 0.254: R6.1 104.78,55.88 106.05,55.88 D11.A
  Bottom 0.254: 107.95,83.19 109.22,81.92 B3.U | 107.95,83.19 107.95,92.08 109.22,93.34 B2.U | 107.95,83.19 107.95,58.42 106.68,57.15 D11.A
DATA2-
  Bottom 0.254: 102.87,81.92 102.87,53.98 107.31,53.98 108.58,55.24 D12.A | 102.87,81.92 104.14,83.19 B3.R | 102.87,81.92 102.87,94.61 104.14,95.89 B2.R
DATA2CT
  Bottom 0.254: B3.P 104.14,81.92 105.41,83.19 105.41,92.08 104.14,93.34 B2.P 104.78,93.98 106.05,95.25 110.49,95.25 110.49,87 113.03,84.45 113.03,48.26 | 113.03,48.26 114.94,50.16 114.94,53.98 116.2,55.24 IC3.6 | 113.03,48.26 111.76,46.99 D13.C
DATA3+  (via drill 0.61)
  Top 0.254: D8.A 106.05,71.12 104.78,71.12 R5.1 103.5,71.12 102.87,71.75 v99.06,71.75
  Bottom 0.254: B2.F 93.98,95.89 92.71,94.61 92.71,85.72 93.98,84.45 B3.F 93.98,83.19 95.25,81.92 95.25,75.56 v99.06,71.75
DATA3-
  Top 0.254: D9.A 109.86,70.48 113.03,67.31 118.11,67.31 118.75,67.94 118.75,78.11 79.38,78.11 72.39,85.09 62.87,85.09 61.59,83.82 A3.TT
  Bottom 0.254: A2.TT 60.96,95.89 59.69,94.61 59.69,85.72 60.96,84.45 A3.TT
DATA3CT
  Top 0.254: D10.C 112.39,60.96 115.57,60.96 IC3.4
  Bottom 0.254: 54.61,92.08 54.61,83.19 55.88,81.92 A3.MM | 54.61,92.08 55.88,93.34 A2.MM | 54.61,92.08 54.61,97.79 94.61,97.79 95.25,97.16 95.25,93.34 100.33,88.27 100.33,53.34 109.22,53.34 110.49,54.61 110.49,58.42 111.76,59.69 D10.C
DRV0
  Top 0.254: IC5.6 39.37,17.78 40.01,17.14 43.81,17.14 44.45,16.51 69.85,16.51 71.12,17.78 72.39,17.78 IC4.6
DRV1  (via drill 0.61)
  Top 0.254: v65.41,21.59 44.45,21.59 43.81,22.23 40.01,22.23 39.37,22.86 IC5.4
  Bottom 0.254: v65.41,21.59 66.67,20.32 66.67,17.14 67.31,16.51 73.03,16.51 73.03,15.88 IC4.7
DRV2  (via drill 0.61)
  Top 0.254: v78.74,36.2 42.55,36.2 42.55,32.38 38.73,28.57 IC5.2
  Bottom 0.254: v78.74,36.2 78.74,15.24 80.64,13.34 IC4.9
DRVOK  (via drill 0.61)
  Top 0.254: v102.23,45.72 99.69,45.72 97.79,43.81 55.24,43.81 54.61,43.18 D26.C
  Bottom 0.254: v102.23,45.72 103.5,46.99 105.41,46.99 105.41,41.91 106.05,41.27 106.05,26.67 103.5,24.13 103.5,19.68 102.23,18.41 IC1.19
FORWARD
  Top 0.254: D27.C 16.51,25.4 RN1.2 19.05,25.4 21.59,27.94 IC8.2
GND  (via drill 0.61)
  Top 0.508: IC2.12 97.79,63.5 100.97,63.5 C8.2 | v88.27,87.63 93.98,93.34 B2.E | IC3.12 125.73,63.5 128.91,63.5 C9.2 130.18,63.5 133.99,63.5 C2.- | IC1.8 95.25,22.86 97.79,25.4 100.33,25.4 IC1.22 102.87,25.4 103.5,26.04 105.41,26.04 107.31,27.94 113.03,27.94 D36.A | D1.A 111.76,19.05 113.03,17.78 113.67,17.78 C1.2 | R2.2 116.84,19.68 114.94,17.78 C1.2 | D32.A 113.67,32.38 113.67,31.11 D37.A | 34.92,5.71 26.04,5.71 24.13,7.62 IC8.10 | 34.92,5.71 36.83,7.62 IC5.10 | v17.78,90.81 20.32,93.34 A2.E | GND.1 8.26,38.73 12.7,38.73 15.88,41.91 C3.+ 17.14,41.91 20.95,41.91 24.77,38.1 Q1.1 | C5.2 38.73,33.02 36.83,34.92 26.67,34.92 24.77,33.02 C4.2 | 34.92,5.71 102.87,5.71 114.3,17.14 C1.2 | v60.33,48.9 41.27,48.9 D31.C
  Bottom 0.508: 76.2,17.78 76.2,15.24 74.3,13.34 IC4.8 | 76.2,17.78 74.3,19.68 IC4.5 | 76.2,17.78 76.2,31.11 74.93,32.38 C6.2 74.93,33.66 74.3,34.29 74.3,48.9 | 93.98,73.66 93.98,66.04 95.89,64.14 IC2.12 | 93.98,73.66 93.98,80.64 B3.E | v88.27,87.63 87,86.36 87,85.09 | 87,85.09 87,80.64 93.98,73.66 | 74.3,48.9 74.3,72.39 87,85.09 | 127.64,47.62 127.64,60.96 129.54,62.87 C9.2 | 127.64,47.62 127.64,43.18 128.27,42.55 J1.11 | J1.14 149.86,13.97 123.83,13.97 123.83,15.88 J1.13 121.28,15.88 114.3,15.88 114.3,17.14 C1.2 | D37.A 113.67,29.84 113.67,28.57 D36.A 113.67,27.3 113.67,26.67 112.39,25.4 C7.2 111.76,24.77 111.76,21.59 D1.A | D32.A 113.67,33.66 113.67,34.92 D33.A 113.67,36.2 113.67,37.47 D35.A 113.67,38.73 113.67,40.01 D34.A 114.94,41.27 114.94,47.62 127.64,47.62 | C5.2 39.37,33.66 38.73,34.29 38.73,46.35 40.01,47.62 D31.C | 25.4,34.92 24.13,33.66 C4.2 | 25.4,34.92 25.4,37.47 Q1.1 | 13.34,73.66 9.53,69.85 9.53,40.01 8.26,38.73 GND.1 | 13.34,73.66 20.32,80.64 A3.E | v17.78,90.81 13.34,86.36 13.34,73.66 | 25.4,34.92 25.4,10.16 23.5,8.26 IC8.10 | v60.33,48.9 74.3,48.9
HALT
  Top 0.254: D30.C 16.51,17.78 RN1.5 18.41,17.14 22.23,13.34 IC8.8
J
  Bottom 0.254: A6.U 35.56,56.52 34.29,57.78 34.29,66.67 35.56,67.94 A5.U
MARK+  (via drill 0.61)
  Top 0.254: D5.A 78.11,55.88 76.83,55.88 R4.1 75.56,55.88 64.14,67.31 v49.53,67.31
  Bottom 0.254: A2.CC 45.72,93.34 46.99,92.08 46.99,83.19 45.72,81.92 A3.CC 45.72,80.64 49.53,76.83 v49.53,67.31
MARK-  (via drill 0.61)
  Top 0.254: v80.01,76.2 73.66,82.55 47.62,82.55 46.35,83.82 A3.DD
  Bottom 0.254: v80.01,76.2 80.01,58.42 81.28,57.15 D6.A | A2.DD 45.72,95.89 44.45,94.61 44.45,85.72 45.72,84.45 A3.DD
MARKCT  (via drill 0.61)
  Top 0.254: v65.41,67.31 74.93,57.78 85.72,57.78 87.63,55.88 IC2.6
  Bottom 0.254: A2.HH 50.8,93.34 49.53,92.08 49.53,83.19 50.8,81.92 A3.HH 51.44,81.28 60.33,72.39 65.41,72.39 v65.41,67.31 | D7.C 83.82,46.99 87,50.16 87,53.98 88.27,55.24 IC2.6
MIN  (via drill 0.61)
  Top 0.254: 28.57,24.13 43.18,24.13 44.45,22.86 IC5.17 | v20.95,24.13 28.57,24.13 | 100.97,43.18 v99.69,44.45 | 100.97,43.18 118.11,43.18 RN2.8 | 28.57,24.13 28.57,31.75 40.01,31.75 41.91,33.66 41.91,36.83 78.11,36.83 80.64,39.37 88.27,39.37 92.08,43.18 100.97,43.18
  Bottom 0.254: v20.95,24.13 20.95,18.41 18.41,15.88 RN1.6 | v99.69,44.45 99.69,62.23 95.25,62.23 89.53,67.94 IC2.1
MOUT  (via drill 0.61)
  Top 0.254: v79.38,11.43 99.06,11.43 100.33,12.7 IC1.17
  Bottom 0.254: v79.38,11.43 77.47,13.34 77.47,43.81 76.2,45.09 R4.2
N$1
  Top 0.254: X1.1 89.53,15.24 92.08,17.78 92.71,17.78 IC1.10
N$2
  Top 0.254: X1.2 89.53,20.32 92.71,20.32 IC1.9
N$3
  Top 0.254: D18.C 64.77,12.7 67.31,12.7 RN3.2 69.85,12.7 71.12,13.97 78.74,13.97 80.01,15.24 IC4.10
N$4
  Top 0.254: D19.C 64.77,15.24 67.31,15.24 RN3.3 69.85,15.24 71.12,16.51 78.74,16.51 80.01,17.78 IC4.11
N$5  (via drill 0.61)
  Top 0.254: D20.C 64.77,17.78 67.31,17.78 RN3.4 | v71.75,21.59 78.74,21.59 80.01,20.32 IC4.12
  Bottom 0.254: v71.75,21.59 70.48,20.32 70.48,19.68 69.22,18.41 RN3.4
N$7
  Top 0.254: D2.C 79.38,60.33 80.64,60.33 D3.C
  Bottom 0.254: IC2.5 87.63,58.42 81.28,58.42 81.28,59.69 D3.C 81.28,62.23 81.28,67.31 83.82,69.85 D4.A
N$8
  Top 0.254: D21.C 64.77,20.32 67.31,20.32 RN3.5 69.85,20.32 71.12,19.05 83.19,19.05 83.19,20.95 81.92,22.23 IC4.13
N$9
  Top 0.254: D22.C 64.77,30.48 67.31,30.48 RN3.9 69.85,30.48 72.39,30.48 IC4.1
N$10
  Top 0.254: D23.C 64.77,27.94 67.31,27.94 RN3.8 69.85,27.94 72.39,27.94 IC4.2
N$11
  Top 0.254: D5.C 79.38,45.09 80.64,45.09 D6.C | D7.A 84.45,55.24 86.36,53.34 87.63,53.34 IC2.7
  Bottom 0.254: D6.C 81.28,46.99 83.82,49.53 83.82,54.61 D7.A
N$12
  Top 0.254: D8.C 107.31,60.33 108.58,60.33 D9.C 109.86,60.33 111.12,59.05 114.94,59.05 115.57,58.42 IC3.5
  Bottom 0.254: D10.A 111.76,69.85 109.22,67.31 109.22,62.23 D9.C
N$13
  Top 0.254: D11.C 107.31,45.09 108.58,45.09 D12.C | D13.A 112.39,55.24 114.3,53.34 115.57,53.34 IC3.7
  Bottom 0.254: D12.C 109.22,46.99 111.76,49.53 111.76,54.61 D13.A
N$14
  Top 0.254: D15.C 132.72,45.09 133.99,45.09 D14.C | IC3.9 125.73,55.88 128.91,55.88 D16.A
  Bottom 0.254: D15.C 132.08,46.99 129.54,49.53 129.54,54.61 D16.A
N$15
  Top 0.254: D24.C 64.77,25.4 67.31,25.4 RN3.7 69.85,25.4 72.39,25.4 IC4.3
N$16
  Top 0.254: D25.C 64.77,22.86 67.31,22.86 RN3.6 69.85,22.86 72.39,22.86 IC4.4
N$17
  Top 0.254: R12.2 92.08,40.64 92.71,40.64 IC1.1
N$18
  Bottom 0.254: Q1.3 26.04,43.18 29.21,43.18 29.21,42.55 33.02,38.73 R10.1
N$19
  Top 0.254: Q1.2 28.57,40.64 29.84,41.91 38.73,41.91 40.01,43.18 R11.2 41.27,43.18 41.91,43.18 D26.A
REVERSE
  Top 0.254: D28.C 16.51,22.86 RN1.3 19.05,22.86 21.59,22.86 IC8.4
SELECT
  Bottom 0.254: 36.83,56.52 36.83,40.01 35.56,38.73 R10.2 | 36.83,56.52 35.56,57.78 A6.V | 36.83,56.52 36.83,69.22 35.56,70.48 A5.V
SHIELD1
  Top 0.508: 35.56,84.45 36.83,85.72 49.53,85.72 50.8,84.45 A3.JJ | 35.56,84.45 A3.V 35.56,84.45 | 36.83,98.42 35.56,97.16 A2.V | 36.83,98.42 49.53,98.42 50.8,97.16 A2.JJ | 35.56,84.45 30.48,89.53 17.14,89.53 13.34,93.34 13.34,98.42 36.83,98.42
SHIELD2
  Top 0.508: 99.06,84.45 106.68,92.08 113.03,92.08 114.3,93.34 B2.Y | 99.06,84.45 B3.L 99.06,84.45 | 65.41,98.42 65.41,93.34 64.14,92.08 63.5,92.08 55.88,84.45 A3.NN | 65.41,98.42 57.15,98.42 55.88,97.16 A2.NN | 65.41,98.42 87,98.42 | 87,98.42 97.79,98.42 99.06,97.16 B2.L | 87,98.42 87,85.72 | 87,85.72 87,80.64 88.27,79.38 113.03,79.38 114.3,80.64 B3.Y | 99.06,84.45 97.79,85.72 87,85.72
SKEW
  Bottom 0.254: A3.F 20.32,84.45 19.05,85.72 19.05,94.61 20.32,95.89 A2.F
STOP
  Top 0.254: D29.C 16.51,20.32 RN1.4 19.05,20.32 21.59,17.78 IC8.6
TIMING+
  Top 0.254: R3.1 76.83,71.12 78.11,71.12 D2.A 79.38,70.48 80.64,69.22 81.92,69.22 82.55,69.85 82.55,74.3 38.1,74.3 31.11,81.28 A3.P
  Bottom 0.254: A3.P 30.48,81.92 31.75,83.19 31.75,92.08 30.48,93.34 A2.P
TIMING-
  Top 0.254: D3.A 80.64,71.75 78.74,73.66 36.2,73.66 29.21,80.64 29.21,83.82 29.84,83.82 A3.R
  Bottom 0.254: A2.R 30.48,95.89 29.21,94.61 29.21,85.72 30.48,84.45 A3.R
TIMINGCT  (via drill 0.61)
  Top 0.254: D4.C 84.45,60.96 87.63,60.96 IC2.4 | v85.09,73.03 83.19,74.93 42.55,74.93 36.2,81.28 A3.U
  Bottom 0.254: A3.U 35.56,81.92 34.29,83.19 34.29,92.08 35.56,93.34 A2.U | v85.09,73.03 85.09,63.5 83.82,62.23 D4.C
TIN
  Bottom 0.254: IC1.6 94.61,28.57 95.89,29.84 95.89,51.44 90.81,56.52 90.81,64.14 89.53,65.41 IC2.2
TOUT  (via drill 0.61)
  Top 0.254: v85.72,21.59 95.25,21.59 100.97,15.88 IC1.18
  Bottom 0.254: v85.72,21.59 83.19,24.13 83.19,41.27 80.01,44.45 80.01,57.15 76.83,60.33 76.83,60.96 R3.2
V+
  Top 0.508: IC2.3 89.53,64.14 95.89,70.48 99.06,70.48 100.97,68.58 C8.1 102.23,68.58 107.31,63.5 115.57,63.5 IC3.3 | C9.1 128.91,68.58 126.36,71.12 122.56,71.12 R8.2
  Bottom 0.508: IC3.3 117.47,64.14 121.28,67.94 121.28,71.12 R8.2
VCC  (via drill 0.61)
  Top 0.508: IC1.21 100.97,22.23 100.97,20.95 IC1.20 102.87,20.32 108.58,20.32 R1.2 | v97.79,22.86 100.33,22.86 IC1.21 | 104.14,23.5 103.5,22.86 102.87,22.86 IC1.21 | 104.14,23.5 106.05,25.4 C7.1 | 104.14,23.5 116.2,23.5 118.11,25.4 RN2.1 120.65,25.4 139.06,25.4 139.06,62.23 135.25,66.04 C2.+ | +5V.1 8.26,29.84 14.61,29.84 16.51,27.94 RN1.1 18.41,28.57 18.41,36.2 40.01,36.2 41.91,38.1 v46.35,38.1 v60.96,38.1 63.5,40.64 80.64,40.64 R12.1 | v87.63,25.4 92.71,25.4 IC1.7 | v84.45,28.57 82.55,30.48 IC4.16
  Bottom 0.508: R8.1 132.08,70.48 134.62,67.94 134.62,66.67 C2.+ | v97.79,22.86 95.25,25.4 IC1.7 | IC8.20 29.84,31.11 29.84,31.75 29.21,32.38 C4.1 29.21,33.66 27.3,35.56 27.3,38.1 25.4,40.01 18.41,40.01 18.41,28.57 RN1.1 | IC4.16 80.64,31.11 80.64,31.75 80.01,32.38 C6.1 80.01,33.66 81.28,34.92 81.28,40.01 R12.1 | IC5.20 45.09,31.11 45.09,31.75 44.45,32.38 C5.1 44.45,33.66 46.35,35.56 v46.35,38.1 | v60.96,38.1 60.96,10.16 67.31,10.16 RN3.1 | v84.45,28.57 v87.63,25.4
VDD  (via drill 0.61)
  Top 0.508: R1.1 109.86,10.16 111.12,10.16 D1.C 112.39,10.79 113.03,10.79 114.3,12.06 C1.1 114.94,12.7 116.84,12.7 v127,22.86
  Bottom 0.508: v127,22.86 127,25.4 123.83,28.57 J1.4
VSS  (via drill 0.61)
  Top 0.508: v125.73,24.13 v128.27,24.13 128.27,22.23 116.84,10.79 R2.1
  Bottom 0.508: v125.73,24.13 123.83,26.04 J1.3 | v128.27,24.13 128.27,29.21 123.83,33.66 J1.6
WE
  Top 0.254: D31.A 31.75,48.26 34.29,45.72 40.01,45.72 R9.2 41.27,45.72 41.91,45.72 D17.A
  Bottom 0.254: D17.A 42.55,46.35 42.55,53.34 40.64,55.24 A6.Y 40.64,56.52 39.37,57.78 39.37,66.67 40.64,67.94 A5.Y